# EAGLE schematic Схема датчиков тока (EAGLE 6.5.0)
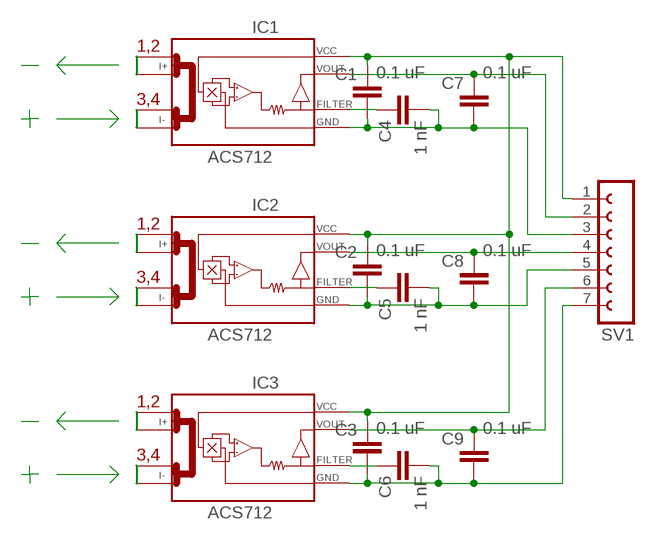
[diagram p0: schematic, sheet 1]

## Parts
C1  C-EU025-024X044  [C025-024X044]
C2  C-EU025-024X044  [C025-024X044]
C3  C-EU025-024X044  [C025-024X044]
C4  1 nF  C-EU025-024X044  [C025-024X044]
C5  1 nF  C-EU025-024X044  [C025-024X044]
C6  1 nF  C-EU025-024X044  [C025-024X044]
C7  C-EU025-024X044  [C025-024X044]
C8  C-EU025-024X044  [C025-024X044]
C9  C-EU025-024X044  [C025-024X044]
IC1  ACS712  [SO08]
IC2  ACS712  [SO08]
IC3  ACS712  [SO08]
SV1  FE07-1  [FE07]

## Nets
N$1: C4.1 IC1.6(FILTER)
N$2: C1.2 C4.2 C7.2 IC1.5(GND) SV1.3
N$4: C7.1 IC1.7(VOUT) SV1.2
N$5: C1.1 C2.1 C3.1 IC1.8(VCC) IC2.8(VCC) IC3.8(VCC) SV1.1
N$6: C2.2 C5.2 C8.2 IC2.5(GND) SV1.5
N$7: C5.1 IC2.6(FILTER)
N$8: C8.1 IC2.7(VOUT) SV1.4
N$9: C9.1 IC3.7(VOUT) SV1.6
N$10: C3.2 C6.2 C9.2 IC3.5(GND) SV1.7
N$11: C6.1 IC3.6(FILTER)
Unconnected: IC1.1(I+_0) IC1.2(I+_1) IC1.3(I-_0) IC1.4(I-_1) IC2.1(I+_0) IC2.2(I+_1) IC2.3(I-_0) IC2.4(I-_1) IC3.1(I+_0) IC3.2(I+_1) IC3.3(I-_0) IC3.4(I-_1)

## Notes on the sheet
- 1,2
- 0.1 uF | 0.1 uF
- 3,4
- 1,2
- 0.1 uF | 0.1 uF
- 3,4
- 1,2
- 0.1 uF | 0.1 uF
- 3,4

## Library data of the parts
C1-C9 = resistor:C-EU: CAPACITOR, European symbol
IC1-IC3 = ACS712:ACS712
SV1 = con-lsta:FE07-1: FEMALE HEADER; OC_FARNELL: unknown; OC_NEWARK: unknown